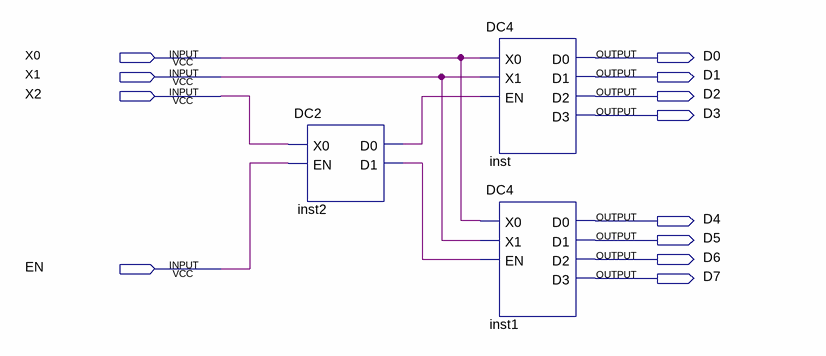
[diagram p0: schematic sheet]
// Quartus schematic DC8.bdf as structural Verilog: 3 symbols, 12 pins
module DC8 (
  input  X0,
  input  X1,
  input  X2,
  input  EN,
  output D0,
  output D1,
  output D2,
  output D3,
  output D4,
  output D5,
  output D6,
  output D7
);

  wire inst2_d0, inst2_d1;

  DC2 inst2 (.X0(X2), .EN(EN), .D0(inst2_d0), .D1(inst2_d1));
  DC4 inst (.X0(X0), .X1(X1), .EN(inst2_d0), .D0(D0), .D1(D1), .D2(D2), .D3(D3));
  DC4 inst1 (.X0(X0), .X1(X1), .EN(inst2_d1), .D0(D4), .D1(D5), .D2(D6), .D3(D7));
endmodule
